# Altium schematic sheet AUDIO.SchDoc
size A3; DocumentNumber: 9; SheetNumber: 9; SheetTotal: 12
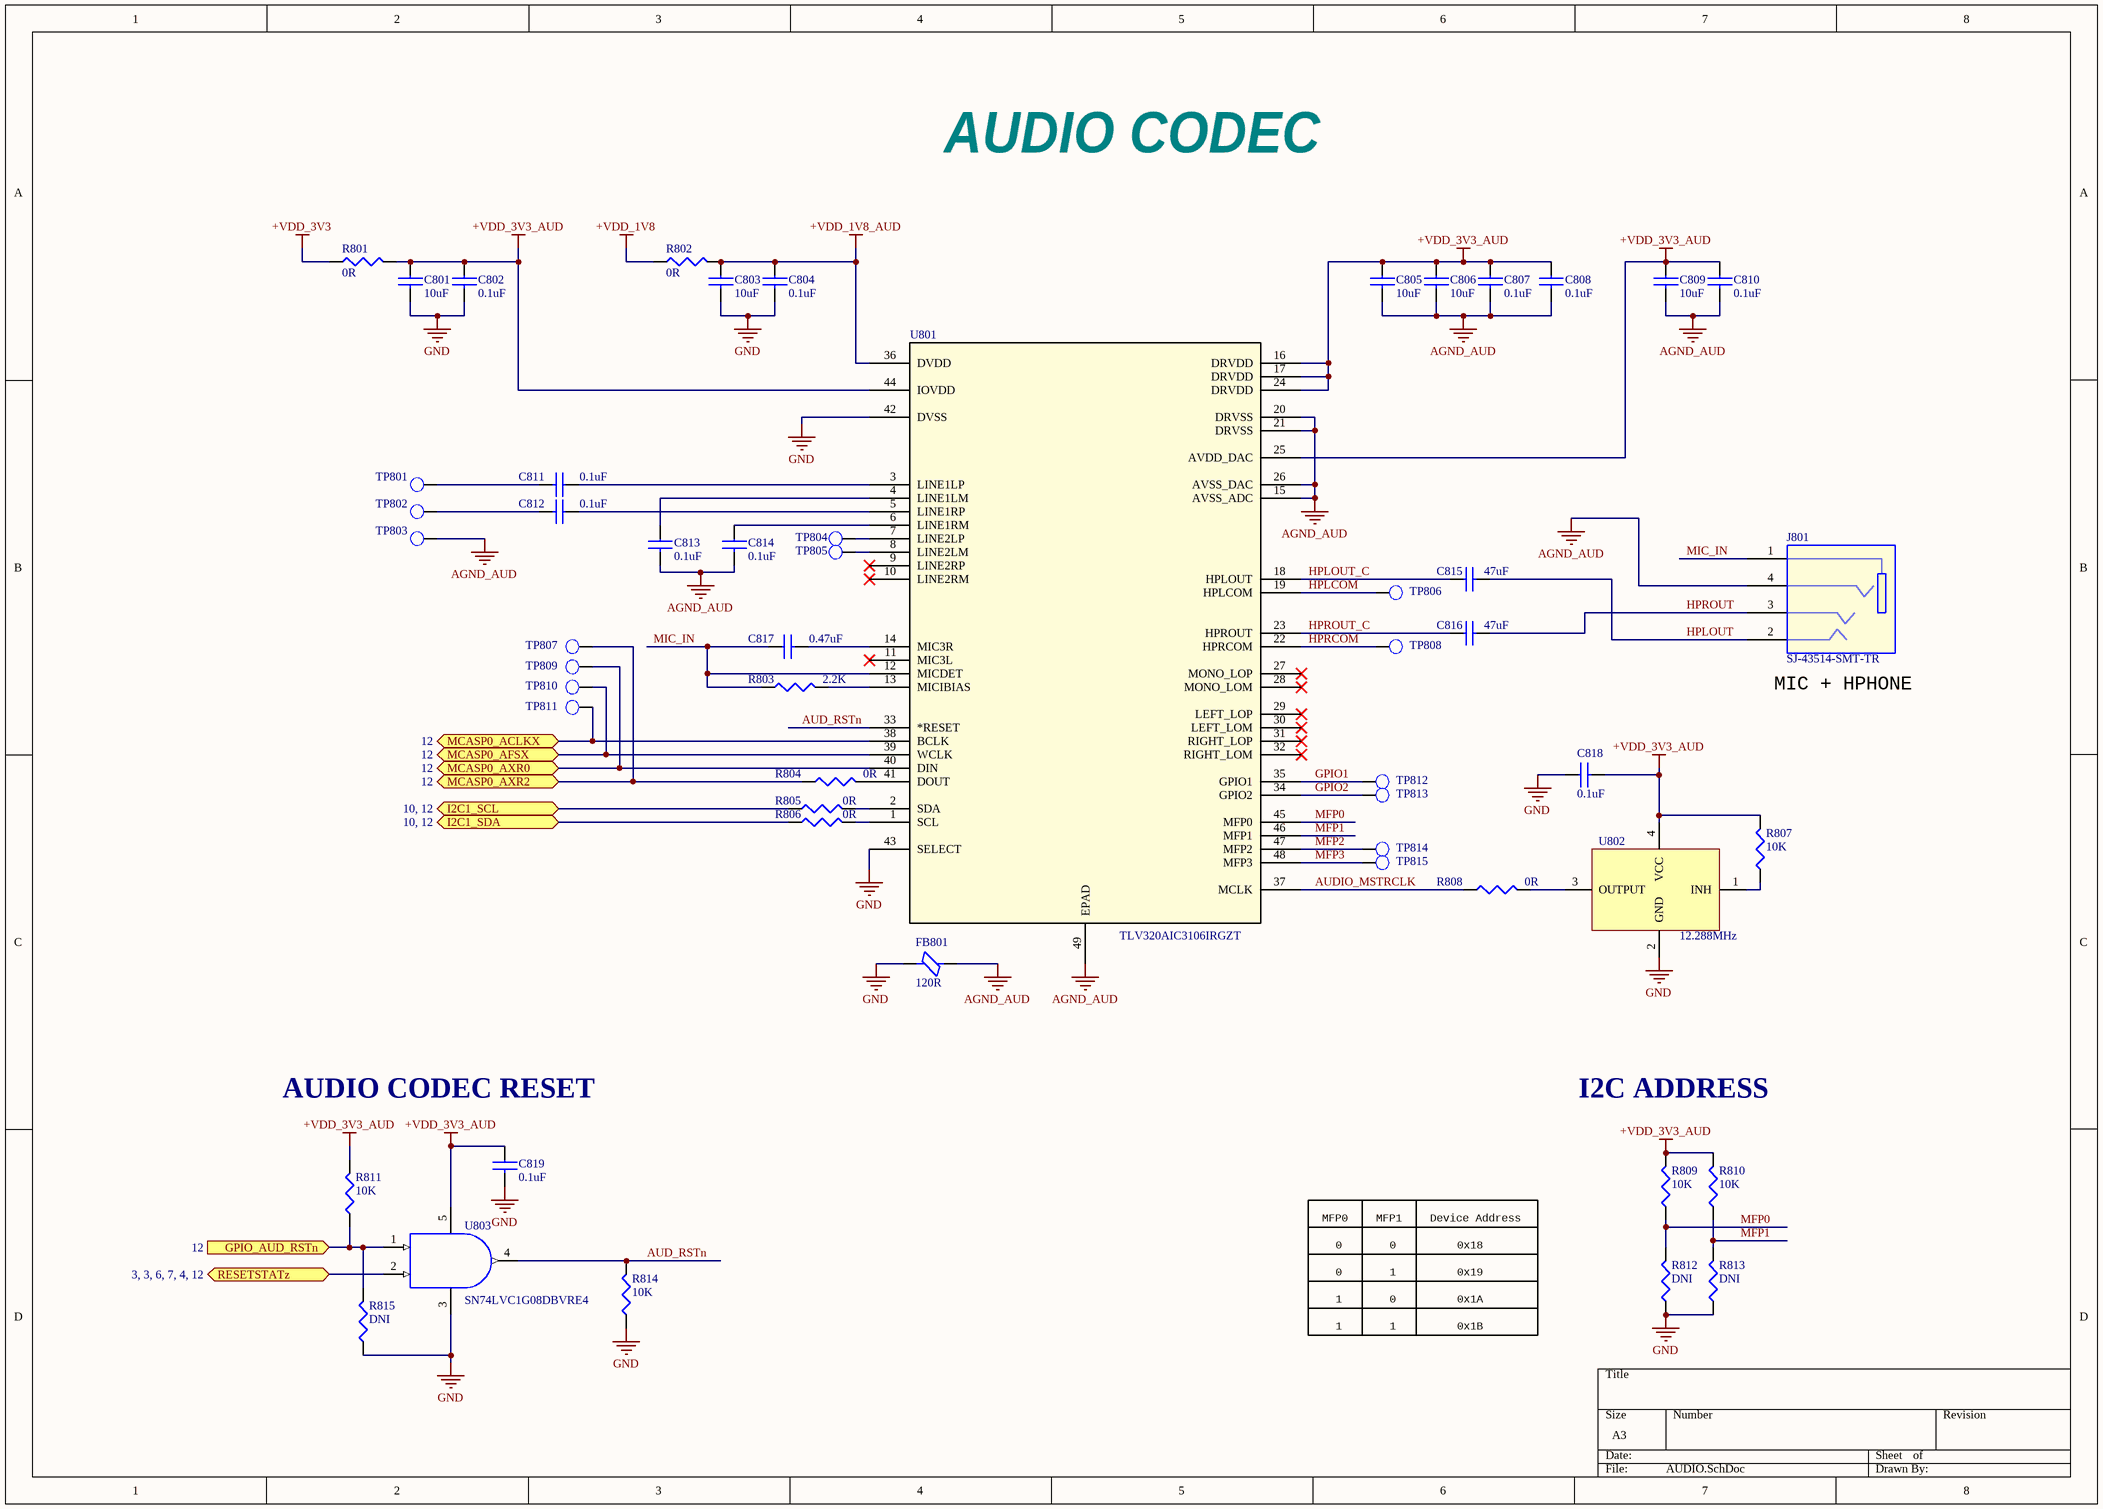
[diagram p0: AUDIO.SchDoc]

## Parts
C801  10uF  [C0402]
C802  0.1uF  [C0201]
C803  10uF  [C0402]
C804  0.1uF  [C0201]
C805  10uF  [C0402]
C806  10uF  [C0402]
C807  0.1uF  [C0201]
C808  0.1uF  [C0201]
C809  10uF  [C0402]
C810  0.1uF  [C0201]
C811  0.1uF  [C0402]
C812  0.1uF  [C0402]
C813  0.1uF  [C0201]
C814  0.1uF  [C0201]
C815  47uF  [C1206B/3216MM]
C816  47uF  [C1206B/3216MM]
C817  0.47uF  [C0402]
C818  0.1uF  [C0201]
C819  0.1uF  [C0402]
FB801  120R  [FB0402]
J801  SJ-43514-SMT-TR  [CON_AV4_SJ-43514-SMT_S_R_S_5-1]
R801  0R  [R0201]
R802  0R  [R0201]
R803  2.2K  [R0201]
R804  0R  [R0201]
R805  0R  [R0402]
R806  0R  [R0402]
R807  10K  [R0201]
R808  0R  [R0201]
R809  10K  [R0201]
R810  10K  [R0201]
R811  10K  [R0201]
R812  DNI  [R0201]
R813  DNI  [R0201]
R814  10K  [R0201]
R815  DNI  [R0201]
TP801  THRU HOLE  [TP_40X65]  (value not drawn)
TP802  THRU HOLE  [TP_40X65]  (value not drawn)
TP803  THRU HOLE  [TP_40X65]  (value not drawn)
TP804  TP20_SMD  [TP20_SMD]  (value not drawn)
TP805  TP20_SMD  [TP20_SMD]  (value not drawn)
TP806  TP20_SMD  [TP20_SMD]  (value not drawn)
TP807  TP20_SMD  [TP20_SMD]  (value not drawn)
TP808  TP20_SMD  [TP20_SMD]  (value not drawn)
TP809  TP20_SMD  [TP20_SMD]  (value not drawn)
TP810  TP20_SMD  [TP20_SMD]  (value not drawn)
TP811  TP20_SMD  [TP20_SMD]  (value not drawn)
TP812  TP20_SMD  [TP20_SMD]  (value not drawn)
TP813  TP20_SMD  [TP20_SMD]  (value not drawn)
TP814  TP20_SMD  [TP20_SMD]  (value not drawn)
TP815  TP20_SMD  [TP20_SMD]  (value not drawn)
U801  TLV320AIC3106IRGZT  [VQFN48_19-68_285X285]
U802  12.288MHz  [OSC4_KC2520B_100X80_SMD_0-8]
U803  SN74LVC1G08DBVRE4  [SOT23-5]

## Ports
GPIO_AUD_RSTn (in, see 12), I2C1_SCL (bidir, see 10, 12), I2C1_SDA (bidir, see 10, 12), MCASP0_ACLKX (bidir, see 12), MCASP0_AFSX (bidir, see 12), MCASP0_AXR0 (bidir, see 12), MCASP0_AXR2 (bidir, see 12), RESETSTATz (bidir, see 3, 3, 6, 7, 4, 12)

## Nets
+VDD_1V8: R802.1
+VDD_1V8_AUD: C803.1 C804.1 R802.2 U801.36(DVDD)
+VDD_3V3: R801.1
+VDD_3V3_AUD: C801.1 C802.1 C805.1 C806.1 C807.1 C808.1 C809.1 C810.1 C818.2 C819.1 R801.2 R807.2 R809.2 R810.2 R811.2 U801.16(DRVDD) U801.17(DRVDD) U801.24(DRVDD) U801.25(AVDD_DAC) U801.44(IOVDD) U802.4(VCC) U803.5(V+)
AGND_AUD: C805.2 C806.2 C807.2 C808.2 C809.2 C810.2 C813.2 C814.2 FB801.1 J801.4 TP803.1(TP) U801.15(AVSS_ADC) U801.20(DRVSS) U801.21(DRVSS) U801.26(AVSS_DAC) U801.49(EPAD)
GND: C801.2 C802.2 C803.2 C804.2 C818.1 C819.2 FB801.2 R812.1 R813.1 R814.1 R815.1 U801.42(DVSS) U801.43(SELECT) U802.2(GND) U803.3(V-)
AUD_RSTn: R814.2 U801.33(*RESET) U803.4(Y)
AUDIO_MSTRCLK: R808.1 U801.37(MCLK)
GPIO1: TP812.1(TP) U801.35(GPIO1)
GPIO2: TP813.1(TP) U801.34(GPIO2)
GPIO_AUD_RSTn: R811.1 R815.2 U803.1(A) ; port GPIO_AUD_RSTn
HPLCOM: TP806.1(TP) U801.19(HPLCOM)
HPLOUT: C815.2 J801.2
HPLOUT_C: C815.1 U801.18(HPLOUT)
HPRCOM: TP808.1(TP) U801.22(HPRCOM)
HPROUT: C816.2 J801.3
HPROUT_C: C816.1 U801.23(HPROUT)
I2C1_SCL: R805.1 ; port I2C1_SCL
I2C1_SDA: R806.1 ; port I2C1_SDA
MCASP0_ACLKX: TP811.1(TP) U801.38(BCLK) ; port MCASP0_ACLKX
MCASP0_AFSX: TP810.1(TP) U801.39(WCLK) ; port MCASP0_AFSX
MCASP0_AXR0: TP809.1(TP) U801.40(DIN) ; port MCASP0_AXR0
MCASP0_AXR2: R804.1 TP807.1(TP) ; port MCASP0_AXR2
MFP0: R809.1 R812.2 U801.45(MFP0)
MFP1: R810.1 R813.2 U801.46(MFP1)
MFP2: TP814.1(TP) U801.47(MFP2)
MFP3: TP815.1(TP) U801.48(MFP3)
MIC_IN: C817.1 J801.1 R803.1 U801.12(MICDET)
RESETSTATz: U803.2(B) ; port RESETSTATz
NetC811_1: C811.1 U801.3(LINE1LP)
NetC811_2: C811.2 TP801.1(TP)
NetC812_1: C812.1 U801.5(LINE1RP)
NetC812_2: C812.2 TP802.1(TP)
NetC813_1: C813.1 U801.4(LINE1LM)
NetC814_1: C814.1 U801.6(LINE1RM)
NetC817_2: C817.2 U801.14(MIC3R)
NetR803_2: R803.2 U801.13(MICIBIAS)
NetR804_2: R804.2 U801.41(DOUT)
NetR805_2: R805.2 U801.2(SDA)
NetR806_2: R806.2 U801.1(SCL)
NetR807_1: R807.1 U802.1(INH)
NetR808_2: R808.2 U802.3(OUTPUT)
NetTP804_1: TP804.1(TP) U801.7(LINE2LP)
NetTP805_1: TP805.1(TP) U801.8(LINE2LM)

Not connected (* = marked no-connect by the designer): U801 9(LINE2RP)* 10(LINE2RM)* 11(MIC3L)* 27(MONO_LOP)* 28(MONO_LOM)* 29(LEFT_LOP)* 30(LEFT_LOM)* 31(RIGHT_LOP)* 32(RIGHT_LOM)*

## Notes on the sheet
- AUDIO CODEC
- (near J801) MIC + HPHONE
- AUDIO CODEC RESET
- I2C ADDRESS
- MFP0
- 0
- MFP1
- Device Address
- 0x18
- 1
- 0x19
- 0x1A
- 0x1B

## Library data of the parts
C801 C803 C805 C806 C809 = GRM155R61A106ME11D: Multilayer Ceramic Capacitor, 10 uF, 10 V, ± 20%, X5R, 0402 [1005 Metric]; Manufacturer: Murata; Material: 4241ConductorMaterial; Dielectric: 1537DielectricType; Voltage Rating: 10V; Supplier 1: Arrow Electronics; Manufacturer Part Number: GRM155R61A106ME11D; RoHS: Yes; Category: Ceramic Capacitors; Stock 1: 100072; Pricing 1: 1=0.08, 10=0.054, 25=0.0281 (USD); Case/Package: 343Case; Min Operating Temperature: -55°C; Max Operating Temperature: 85°C; Capacitance: 10uF; Tolerance: 20%; Voltage Rating (DC): 10V; Length: 1mm; Width: 500um; Height: 700um; Thickness: 500um; RoHS Compliant: Yes; ComponentLink1URL: https://datasheet.octopart.com/GRM155R61A106ME11D-Murata-datasheet-155239053.pdf?src-supplier=Element14; ComponentLink1Description: https://datasheet.octopart.com/GRM155R61A106ME11D-Murata-datasheet-155239053.pdf?src-supplier=Element14; ComponentLink2URL: https://datasheet.octopart.com/GRM155R61A106ME11D-Murata-datasheet-165579666.pdf?src-supplier=TME; ComponentLink2Description: https://datasheet.octopart.com/GRM155R61A106ME11D-Murata-datasheet-165579666.pdf?src-supplier=TME; Supplier Part Number 1: GRM155R61A106ME11D
C802 C804 C807 C808 C810 C813 C814 C818 = GRM033R61C104KE14D: Multilayer Ceramic Capacitor, 0.1 uF, 16 V, ± 10%, X5R, 0201 [0603 Metric]; Manufacturer: Murata; Material: 4241ConductorMaterial; Capacitance: 100nF; Voltage Rating (DC): 16V; Supplier 1: Arrow Electronics; Manufacturer Part Number: GRM033R61C104KE14D; RoHS: Yes; Category: Ceramic Capacitors; Stock 1: 8280000; Pricing 1: 15000=0.0039 (USD); Mount: Surface Mount; Case/Package: 0201; Case Code (Imperial): 0201; Case Code (Metric): 0603; Min Operating Temperature: -55°C; Max Operating Temperature: 85°C; Tolerance: 10%; Dielectric: X5R; Series: GRM; Voltage Rating: 16V; Packaging: Tape and Reel; Length: 600um; Width: 300um; Height: 330um; Thickness: 300um; RoHS Compliant: Yes; ComponentLink1URL: http://www.farnell.com/datasheets/2892233.pdf?src-supplier=Farnell; ComponentLink1Description: http://www.farnell.com/datasheets/2892233.pdf?src-supplier=Farnell; ComponentLink2URL: http://www.farnell.com/datasheets/2892233.pdf?src-supplier=Newark; ComponentLink2Description: http://www.farnell.com/datasheets/2892233.pdf?src-supplier=Newark; ComponentLink3URL: http://search.murata.co.jp/Ceramy/image/img/A01X/G101/ENG/GRM033R61C104KE14-01.pdf?src-supplier=Digikey; ComponentLink3Description: http://search.murata.co.jp/Ceramy/image/img/A01X/G101/ENG/GRM033R61C104KE14-01.pdf?src-supplier=Digikey; ComponentLink4URL: https://search.murata.co.jp/Ceramy/image/img/A01X/G101/ENG/GRM033R61C104KE14-01.pdf?src-supplier=Digikey; ComponentLink4Description: https://search.murata.co.jp/Ceramy/image/img/A01X/G101/ENG/GRM033R61C104KE14-01.pdf?src-supplier=Digikey; ComponentLink5URL: https://datasheet.octopart.com/GRM033R61C104KE14D-Murata-datasheet-165579666.pdf?src-supplier=TME; ComponentLink5Description: https://datasheet.octopart.com/GRM033R61C104KE14D-Murata-datasheet-165579666.pdf?src-supplier=TME; Supplier Part Number 1: GRM033R61C104KE14D
C811 C812 C819 = GRM155R71H104KE14D: Multilayer Ceramic Capacitor, 0.1 uF, 50 V, ± 10%, X7R, 0402 [1005 Metric]; Manufacturer: Murata; Capacitance: 100nF; Voltage Rating: 50V; Dissipation Factor: 0.025%; Supplier 1: Arrow Electronics; Manufacturer Part Number: GRM155R71H104KE14D; RoHS: Yes; Category: Ceramic Capacitors; Stock 1: 6020000; Pricing 1: 10000=0.0046, 30000=0.0042, 50000=0.0037, 100000=0.0028 (USD); Mount: Surface Mount; Case/Package: 0402; Number of Pins: 2NUMBER; Case Code (Metric): 1005; Material: Ceramic; Case Code (Imperial): 0402; Weight: 0.000212oz; Dielectric Material: Ceramic; Min Operating Temperature: -55°C; Max Operating Temperature: 125°C; Tolerance: 10%; Packaging: Tape and Reel; Dielectric: X7R; Termination: SMD/SMT; Voltage: 50V; Voltage Rating (DC): 50V; Package Quantity: 10000; Series: GRM; Construction: Flat; Length: 1mm; Width: 0.5mm; Height: 0.5mm; Thickness: 0.022inch; Depth: 0.5mm; Reach SVHC Compliant: No; RoHS Compliant: Yes; Lead Free: 5697LeadFree; ComponentLink1URL: http://www.farnell.com/datasheets/2079156.pdf?src-supplier=Farnell; ComponentLink1Description: http://www.farnell.com/datasheets/2079156.pdf?src-supplier=Farnell; ComponentLink2URL: http://www.mouser.com/ds/2/281/c02e-2905.pdf?src-supplier=Mouser; ComponentLink2Description: http://www.mouser.com/ds/2/281/c02e-2905.pdf?src-supplier=Mouser; ComponentLink3URL: https://datasheet.octopart.com/GRM155R71H104KE14D-Murata-datasheet-22122223.pdf?src-supplier=Future+Electronics; ComponentLink3Description: https://datasheet.octopart.com/GRM155R71H104KE14D-Murata-datasheet-22122223.pdf?src-supplier=Future+Electronics; ComponentLink4URL: http://www.farnell.com/datasheets/2079156.pdf?src-supplier=Newark; ComponentLink4Description: http://www.farnell.com/datasheets/2079156.pdf?src-supplier=Newark; ComponentLink5URL: https://datasheet.octopart.com/GRM155R71H104KE14D-Murata-datasheet-66077078.pdf?src-supplier=Element14; ComponentLink5Description: https://datasheet.octopart.com/GRM155R71H104KE14D-Murata-datasheet-66077078.pdf?src-supplier=Element14; ComponentLink6URL: https://search.murata.co.jp/Ceramy/image/img/A01X/G101/ENG/GRM155R71H104KE14-01.pdf?src-supplier=Digikey; ComponentLink6Description: https://search.murata.co.jp/Ceramy/image/img/A01X/G101/ENG/GRM155R71H104KE14-01.pdf?src-supplier=Digikey; Supplier Part Number 1: GRM155R71H104KE14D
C815 C816 = GRM31CR61A476ME15L: Multilayer Ceramic Capacitor, 47 uF, 10 V, ± 20%, X5R, 1206 [3216 Metric]; Manufacturer: Murata; Supplier 1: Arrow Electronics; Manufacturer Part Number: GRM31CR61A476ME15L; RoHS: Yes; Category: Ceramic Capacitors; Stock 1: 120000; Pricing 1: 2000=0.1162, 4000=0.1078, 10000=0.0977, 50000=0.0818 (USD); ComponentLink1URL: https://datasheet.ciiva.com/6031/1697710-6031936.pdf?src-supplier=Farnell; ComponentLink1Description: https://datasheet.ciiva.com/6031/1697710-6031936.pdf?src-supplier=Farnell; ComponentLink2URL: https://datasheet.ciiva.com/3779/2151grm31cr61a476me1523-3779480.pdf?src-supplier=Arrow+Electronics; ComponentLink2Description: https://datasheet.ciiva.com/3779/2151grm31cr61a476me1523-3779480.pdf?src-supplier=Arrow+Electronics; ComponentLink3URL: https://datasheet.ciiva.com/16461/product-16461242.pdf?src-supplier=Future+Electronics; ComponentLink3Description: https://datasheet.ciiva.com/16461/product-16461242.pdf?src-supplier=Future+Electronics; ComponentLink4URL: https://datasheet.ciiva.com/7719/1697710-7719146.pdf?src-supplier=Element14; ComponentLink4Description: https://datasheet.ciiva.com/7719/1697710-7719146.pdf?src-supplier=Element14; ComponentLink5URL: https://datasheet.ciiva.com/5416/product-5416711.pdf?src-supplier=Mouser; ComponentLink5Description: https://datasheet.ciiva.com/5416/product-5416711.pdf?src-supplier=Mouser; ComponentLink6URL: https://datasheet.ciiva.com/14116/grmseries-highdielectrictype-eng-14116399.pdf?src-supplier=Distrelec; ComponentLink6Description: https://datasheet.ciiva.com/14116/grmseries-highdielectrictype-eng-14116399.pdf?src-supplier=Distrelec; ComponentLink7URL: https://datasheet.ciiva.com/11606/product-11606488.pdf?src-supplier=Avnet; ComponentLink7Description: https://datasheet.ciiva.com/11606/product-11606488.pdf?src-supplier=Avnet; ComponentLink8URL: https://datasheet.ciiva.com/141/partnumbering-e-01-141779.pdf?src-supplier=Digikey; ComponentLink8Description: https://datasheet.ciiva.com/141/partnumbering-e-01-141779.pdf?src-supplier=Digikey; ComponentLink9URL: https://datasheet.ciiva.com/141/partnumbering-e-01-141780.pdf?src-supplier=Digikey; ComponentLink9Description: https://datasheet.ciiva.com/141/partnumbering-e-01-141780.pdf?src-supplier=Digikey; ComponentLink10URL: https://datasheet.ciiva.com/141/partnumbering-e-01-141781.pdf?src-supplier=Digikey; ComponentLink10Description: https://datasheet.ciiva.com/141/partnumbering-e-01-141781.pdf?src-supplier=Digikey; Supplier Part Number 1: GRM31CR61A476ME15L
C817 = GRM155R71A474KE01D: Multilayer Ceramic Capacitor, 0.47 uF, 10 V, ± 10%, X7R, 0402 [1005 Metric]; Manufacturer: Murata; Voltage Rating (DC): 10V; Capacitance: 470nF; Supplier 1: Arrow Electronics; Manufacturer Part Number: GRM155R71A474KE01D; RoHS: Yes; Category: Ceramic Capacitors; Stock 1: 75675; Pricing 1: 1=0.1817, 10=0.1593, 25=0.1555, 100=0.1462, 250=0.1449, 500=0.1371, 1000=0.1361, 3000=0.1351, 6000=0.1341, 15000=0.1331, 30000=0.1322, 75000=0.1312 (USD); Case/Package: 0402; Number of Pins: 2NUMBER; Material: Ceramic; Min Operating Temperature: -55°C; Max Operating Temperature: 125°C; Tolerance: 10%; Voltage Rating: 10V; Length: 1mm; Width: 0.5mm; Height: 0.3mm; Thickness: 500um; Lead Free: Lead Free; RoHS Compliant: Yes; ComponentLink1URL: https://datasheet.octopart.com/GRM155R71A474KE01D-Murata-datasheet-149523060.pdf?src-supplier=Newark; ComponentLink1Description: https://datasheet.octopart.com/GRM155R71A474KE01D-Murata-datasheet-149523060.pdf?src-supplier=Newark; ComponentLink2URL: https://datasheet.octopart.com/GRM155R71A474KE01D-Murata-datasheet-32479577.pdf?src-supplier=Future+Electronics; ComponentLink2Description: https://datasheet.octopart.com/GRM155R71A474KE01D-Murata-datasheet-32479577.pdf?src-supplier=Future+Electronics; ComponentLink3URL: http://search.murata.co.jp/Ceramy/image/img/A01X/G101/ENG/GRM155R71A474KE01-01.pdf?src-supplier=Digikey; ComponentLink3Description: http://search.murata.co.jp/Ceramy/image/img/A01X/G101/ENG/GRM155R71A474KE01-01.pdf?src-supplier=Digikey; ComponentLink4URL: https://datasheet.octopart.com/GRM155R71A474KE01D-Murata-datasheet-165579666.pdf?src-supplier=TME; ComponentLink4Description: https://datasheet.octopart.com/GRM155R71A474KE01D-Murata-datasheet-165579666.pdf?src-supplier=TME; Supplier Part Number 1: GRM155R71A474KE01D
FB801 = BLM15PD121SZ1D: Ferrite Beads Multi-Layer 120Ohm 25% 100MHz 1.3A 0.09Ohm DCR 0402 Automotive T/R; Manufacturer: Murata; Core Material: 228ConductorMaterial; Number of Lines: 1; Resistance: 90mR; Supplier 1: Arrow Electronics; Manufacturer Part Number: BLM15PD121SZ1D; RoHS: Yes; Category: Ferrite Beads and Chips; Stock 1: 10000; Pricing 1: 10000=0.0178, 20000=0.0168, 30000=0.016, 50000=0.0158 (USD); Mount: Surface Mount; Case/Package: 0402; Case Code (Imperial): 0402; Case Code (Metric): 1005; Min Operating Temperature: -55°C; Max Operating Temperature: 125°C; Packaging: Cut Tape; Max Current Rating: 1.3A; Series: EMIFIL®, BLM15; RMS Current (Irms): 1.3A; Series Resistance: 90mR; Test Frequency: 100MHz; Tolerance: 25%; Height: 550um; Ratings: AEC-Q200; RoHS Compliant: Yes; ComponentLink1URL: https://www.murata.com/en-us/products/productdata/8796748677150/QNFA9118.pdf?src-supplier=Digi-Key; ComponentLink1Description: https://www.murata.com/en-us/products/productdata/8796748677150/QNFA9118.pdf?src-supplier=Digi-Key; Supplier Part Number 1: BLM15PD121SZ1D
J801 = SJ-43514-SMT-TR: 3.5 mm, 4 Conductors, Right Angle, Surface Mount (SMT), Audio Jack Connector; Manufacturer: CUI Devices; Supplier 1: Arrow Electronics; Manufacturer Part Number: SJ-43514-SMT-TR; RoHS: Yes; Category: Audio / Video Connectors; Stock 1: 15500; Pricing 1: 5000=0.498, 6000=0.493, 10000=0.4893 (USD); ComponentLink1URL: https://datasheet.octopart.com/SJ-43514-SMT-TR-CUI-Devices-datasheet-137916562.pdf?src-supplier=Future+Electronics; ComponentLink1Description: https://datasheet.octopart.com/SJ-43514-SMT-TR-CUI-Devices-datasheet-137916562.pdf?src-supplier=Future+Electronics; ComponentLink2URL: https://www.cuidevices.com/product/resource/digikeypdf/sj-4351x-smt.pdf?src-supplier=Digikey; ComponentLink2Description: https://www.cuidevices.com/product/resource/digikeypdf/sj-4351x-smt.pdf?src-supplier=Digikey; Supplier Part Number 1: SJ-43514-SMT-TR
R801 R802 R804 R808 = RC0201JR-070RL: Zero Ohm Resistor, Jumper, 0201 [0603 Metric], Thick Film, 50 mW, 500 mA, Surface Mount; Manufacturer: Yageo; Power Rating: 50mW; Tolerance: 5%; Voltage Rating: 25V; Temperature Coefficient: 200ppm/°C; Supplier 1: Future Electronics; Manufacturer Part Number: RC0201JR-070RL; RoHS: Yes; Category: Chip SMD Resistors; Stock 1: 7600000; Pricing 1: 10000=0.0009, 50000=0.0009, 250000=0.0008, 500000=0.0008, 1500000=0.0007 (USD); Case/Package: 0201; Contact Plating: Tin,Matte; Case Code (Metric): 0603; Case Code (Imperial): 0201; Weight: 6E-06oz; Size Code: 0201; Min Operating Temperature: -55°C; Max Operating Temperature: 125°C; Resistor Type: Thick Film; Packaging: Tape and Reel; Resistance: 0R; Package Quantity: 1; Series: RC; Number of Terminations: 2; Termination: SMD/SMT; Max Power Dissipation: 50mW; Voltage Rating (DC): 25V; Features: Moisture Resistant; Resistance Tolerance: 5%; Length: 0.024inch; Width: 0.012inch; Height: 0.01inch; RoHS Compliant: Yes; Lead Free: Lead Free; Reach SVHC Compliant: Unknown; ComponentLink1URL: https://datasheet.ciiva.com/7672/1563626-7672248.pdf?src-supplier=Element14; ComponentLink1Description: https://datasheet.ciiva.com/7672/1563626-7672248.pdf?src-supplier=Element14; ComponentLink2URL: https://datasheet.ciiva.com/7660/1421516-7660808.pdf?src-supplier=Element14; ComponentLink2Description: https://datasheet.ciiva.com/7660/1421516-7660808.pdf?src-supplier=Element14; ComponentLink3URL: https://datasheet.ciiva.com/8896/pyu-rc0201-51-rohs-l-8-8896143.pdf?src-supplier=Avnet; ComponentLink3Description: https://datasheet.ciiva.com/8896/pyu-rc0201-51-rohs-l-8-8896143.pdf?src-supplier=Avnet; ComponentLink4URL: https://datasheet.ciiva.com/7672/1563626-7672247.pdf?src-supplier=Element14; ComponentLink4Description: https://datasheet.ciiva.com/7672/1563626-7672247.pdf?src-supplier=Element14; ComponentLink5URL: https://datasheet.ciiva.com/46391/1421516-46391340.pdf?src-supplier=Element14; ComponentLink5Description: https://datasheet.ciiva.com/46391/1421516-46391340.pdf?src-supplier=Element14; Supplier Part Number 1: 9983388
R803 = RC0201FR-072K2L: SMD Chip Resistor, 2.2 kOhm, ± 1%, 50 mW, 0201 [0603 Metric], Thick Film, General Purpose; Manufacturer: Yageo; Supplier 1: Future Electronics; Manufacturer Part Number: RC0201FR-072K2L; RoHS: Yes; Category: Chip SMD Resistors; Stock 1: 2030000; Pricing 1: 10000=0.0008, 50000=0.0008, 300000=0.0007, 1000000=0.0007, 3000000=0.0006 (USD); ComponentLink1URL: https://datasheet.ciiva.com/7672/1563626-7672218.pdf?src-supplier=Element14; ComponentLink1Description: https://datasheet.ciiva.com/7672/1563626-7672218.pdf?src-supplier=Element14; Supplier Part Number 1: 3937737
R805 R806 = RC0402JR-070RL: Zero Ohm Resistor, Jumper, 0402 [1005 Metric], Thick Film, 63 mW, 1 A, Surface Mount; Manufacturer: Yageo; Resistance: 0mR; Power Rating: 62.5mW; Tolerance: 5%; Voltage Rating: 50V; Max Power Dissipation: 63mW; Temperature Coefficient: 200ppm/°C; Supplier 1: Future Electronics; Manufacturer Part Number: RC0402JR-070RL; RoHS: Yes; Category: Chip SMD Resistors; Stock 1: 51030000; Pricing 1: 10000=0.0009, 50000=0.0008, 250000=0.0008, 500000=0.0007, 1500000=0.0007 (USD); Case/Package: 0402; Contact Plating: Tin,Matte; Case Code (Metric): 1005; Case Code (Imperial): 0402; Size Code: 0402; Min Operating Temperature: -55°C; Max Operating Temperature: 155°C; Packaging: Tape and Reel; Resistor Type: Thick Film; Number of Terminations: 2; Termination: SMD/SMT; Features: Moisture Resistant; Series: RC; Package Quantity: 1; Technology: THICK FILM; Resistance Tolerance: 5%; Construction: Rectangular; Length: 1mm; Width: 0.02inch; Height: 0.016inch; Depth: 0.5mm; Lead Free: 5697LeadFree; Reach SVHC Compliant: Unknown; RoHS Compliant: Yes; Military Standard: Not; Supplier Part Number 1: 3375797
R807 R809-R815 = RC0201JR-0710KL: Res Thick Film 0201 10K Ohm 5% 1/20W ±200ppm/°C Molded SMD SMD Paper T/R; Manufacturer: Yageo; Resistance: 10kR; Power Rating: 50mW; Voltage Rating: 25V; Supplier 1: Future Electronics; Manufacturer Part Number: RC0201JR-0710KL; RoHS: Yes; Category: Chip SMD Resistors; Stock 1: 90000; Pricing 1: 10000=0.0006, 100000=0.0006, 400000=0.0005, 1250000=0.0005, 4000000=0.0005 (USD); Case/Package: 0201; Contact Plating: Tin,Matte; Case Code (Imperial): 0201; Case Code (Metric): 0603; Size Code: 0201; Min Operating Temperature: -55°C; Max Operating Temperature: 125°C; Tolerance: 5%; Resistor Type: Thick Film; Temperature Coefficient: 200ppm/°C; Packaging: Tape and Reel; Termination: SMD/SMT; Voltage Rating (DC): 25V; Features: Moisture Resistant; Series: RC; Max Power Dissipation: 50mW; Number of Terminations: 2; Resistance Tolerance: 5%; Lead Free: Lead Free; RoHS Compliant: Yes; Reach SVHC Compliant: Unknown; ComponentLink1URL: https://datasheet.ciiva.com/7660/1421516-7660810.pdf?src-supplier=Element14; ComponentLink1Description: https://datasheet.ciiva.com/7660/1421516-7660810.pdf?src-supplier=Element14; ComponentLink2URL: https://datasheet.ciiva.com/8891/pyu-rc0201-51-rohs-l-8-8891388.pdf?src-supplier=Avnet; ComponentLink2Description: https://datasheet.ciiva.com/8891/pyu-rc0201-51-rohs-l-8-8891388.pdf?src-supplier=Avnet; ComponentLink3URL: https://datasheet.ciiva.com/7672/1563626-7672254.pdf?src-supplier=Element14; ComponentLink3Description: https://datasheet.ciiva.com/7672/1563626-7672254.pdf?src-supplier=Element14; ComponentLink4URL: https://datasheet.ciiva.com/7672/1563626-7672253.pdf?src-supplier=Element14; ComponentLink4Description: https://datasheet.ciiva.com/7672/1563626-7672253.pdf?src-supplier=Element14; ComponentLink5URL: https://datasheet.ciiva.com/46391/1421516-46391291.pdf?src-supplier=Element14; ComponentLink5Description: https://datasheet.ciiva.com/46391/1421516-46391291.pdf?src-supplier=Element14; Supplier Part Number 1: 5556147
TP801-TP803 = TESTPOINT: TESTPOINT 1.0MM DRILL PTH; Mfr_name: LOCAL; Mistral Part No: 130009030938; Project: HSE; PCB Footprint: TP_40X65; Library Ref: TESTPOINT; Datasheet: NA; Chkd/date: MAZHAR/271211; Crtd /date: SHREESHAIL/041005; Height: NA; Distributor_part_number: NA; Distributor_name: NA; Package: THRU-HOLE; Part_type: TESTPOINT; Mfr_part_number: TP_40X65
TP804-TP815 = TESTPOINT_1: TESTPOINT CIR 20 SMD; Mistral Part No: NA; Mfr_name: LOCAL; Project: BT MODULE_CSRBC04; PCB Footprint: TP20_SMD; RoHS: NA; Mfr_part_number: TP20_SMD; Part_type: TESTPOINT; Package: SMD; Distributor_name: NA; Distributor_part_number: NA; Height: NA; Crtd /date: MAZHAR/171006; Chkd/date: SHREESHAIL/171006; Tolerance: NA; Voltage: NA; Wattage: NA; Weight: NA; Temperature: NA; Datasheet: NA; MECHANICAL 3D STEP FILE: NA; Library Path: Y:\MIS_DATABASE\Library\ALTIUM_TOOL\SCHEMATICS_PARTS\MS_DISCRETE_Library.schlib; Footprint Path: Y:\MIS_DATABASE\Library\ALTIUM_TOOL\PCB_FOOTPRINTS\Altium_Footprint_Lib.PcbLib; Library Ref: TESTPOINT; Footprint Ref: TP20_SMD; Customs_HS_Code: NA; Custom_Duty: NA
U801 = TLV320AIC3204IRHBR: Very-Low-Power Stereo Audio CODEC With PowerTune Technology 32-VQFN -40 to 85; Manufacturer: Texas Instruments; Supplier 1: Mouser; Manufacturer Part Number: TLV320AIC3204IRHBR; RoHS: Yes; Category: Amplifiers - Audio; Stock 1: 4883; Pricing 1: 1=4.76, 10=4.28, 50=4.28, 100=3.5, 1000=2.51, 10000=2.39 (USD); ComponentLink1URL: https://datasheet.ciiva.com/1148/tlv320aic3204-1148166.pdf?src-supplier=Newark; ComponentLink1Description: https://datasheet.ciiva.com/1148/tlv320aic3204-1148166.pdf?src-supplier=Newark; ComponentLink2URL: https://datasheet.ciiva.com/1141/1764454-1141057.pdf?src-supplier=Element14; ComponentLink2Description: https://datasheet.ciiva.com/1141/1764454-1141057.pdf?src-supplier=Element14; ComponentLink3URL: https://datasheet.ciiva.com/26913/getdatasheetpartid-301856-26913275.pdf?src-supplier=Verical; ComponentLink3Description: https://datasheet.ciiva.com/26913/getdatasheetpartid-301856-26913275.pdf?src-supplier=Verical; ComponentLink4URL: https://datasheet.ciiva.com/28421/1887548-28421445.pdf?src-supplier=Element14; ComponentLink4Description: https://datasheet.ciiva.com/28421/1887548-28421445.pdf?src-supplier=Element14; ComponentLink5URL: https://datasheet.ciiva.com/1691/tlv320aic3204-1691483.pdf?src-supplier=Digi-Key; ComponentLink5Description: https://datasheet.ciiva.com/1691/tlv320aic3204-1691483.pdf?src-supplier=Digi-Key; ComponentLink6URL: https://datasheet.ciiva.com/1691/tlv320aic3204-1691484.pdf?src-supplier=Digi-Key; ComponentLink6Description: https://datasheet.ciiva.com/1691/tlv320aic3204-1691484.pdf?src-supplier=Digi-Key; ComponentLink7URL: https://datasheet.ciiva.com/1691/tlv320aic3204-1691485.pdf?src-supplier=Digi-Key; ComponentLink7Description: https://datasheet.ciiva.com/1691/tlv320aic3204-1691485.pdf?src-supplier=Digi-Key; Supplier Part Number 1: 595-V320AIC3204IRHBR
U802 = XTAL OSC XO 12.2880MHZ CMOS SMD: 12.288 MHz XO (Standard) CMOS Oscillator 1.71V ~ 3.63V Standby (Power Down) 4-SMD, No Lead; Manufacturer: Kyocera AVX; Manufacturer Part Number: KC2520Z12.2880C1KX00; Supplier 1: Digikey; RoHS: No; Stock 1: 9396; Pricing 1: 1=1.21, 10=1.066, 50=0.9966, 100=0.8806, 500=0.8343, 1000=0.69525 (USD); Supplier Part Number 1: 478-KC2520Z12.2880C1KX00CT-ND
U803 = SN74LVC1G08DBVRE4: Single 2-input, 1.65-V to 5.5-V AND gate 5-SOT-23 -40 to 125; Manufacturer: Texas Instruments; Output Current: 32mA; Number of Inputs: 2; Min Supply Voltage: 1.65V; Max Supply Voltage: 5.5V; Number of Outputs: 1; Propagation Delay: 4ns; Quiescent Current: 10uA; High Level Output Current: -32mA; Turn-On Delay Time: 4.5ns; Supplier 1: Mouser; Manufacturer Part Number: SN74LVC1G08DBVRE4; RoHS: Yes; Category: Logic Gates; Stock 1: 9321; Pricing 1: 1=0.41, 10=0.317, 50=0.317, 100=0.197, 1000=0.128, 10000=0.102 (USD); Mount: Surface Mount; Case/Package: SOT-23-5; Number of Pins: 5; Weight: 0.000557oz; Min Operating Temperature: -40°C; Max Operating Temperature: 125°C; Packaging: Tape and Reel; Logic Function: AND GATE; Package Quantity: 3000; Number of Circuits: 1; Low Level Output Current: 32mA; Number of Gates: 1; Number of Input Lines: 2; Number of Output Lines: 1; Number of Elements: 1; Number of Bits: 1; Series: 74LVC; Technology: CMOS; Radiation Hardening: No; Reach SVHC Compliant: No; Lead Free: Lead Free; RoHS Compliant: Yes; ComponentLink1URL: https://datasheet.ciiva.com/18572/sn74lvc1g08-18572331.pdf?src-supplier=Digi-Key; ComponentLink1Description: https://datasheet.ciiva.com/18572/sn74lvc1g08-18572331.pdf?src-supplier=Digi-Key; ComponentLink2URL: https://datasheet.ciiva.com/18572/sn74lvc1g08-18572330.pdf?src-supplier=Digi-Key; ComponentLink2Description: https://datasheet.ciiva.com/18572/sn74lvc1g08-18572330.pdf?src-supplier=Digi-Key; ComponentLink3URL: https://datasheet.ciiva.com/18572/sn74lvc1g08-18572332.pdf?src-supplier=Digi-Key; ComponentLink3Description: https://datasheet.ciiva.com/18572/sn74lvc1g08-18572332.pdf?src-supplier=Digi-Key; ComponentLink4URL: https://datasheet.ciiva.com/4818/sces217y-471056-4818205.pdf?src-supplier=Mouser; ComponentLink4Description: https://datasheet.ciiva.com/4818/sces217y-471056-4818205.pdf?src-supplier=Mouser; ComponentLink5URL: https://datasheet.ciiva.com/14312/sn74lvc1g08-14312069.pdf?src-supplier=Avnet; ComponentLink5Description: https://datasheet.ciiva.com/14312/sn74lvc1g08-14312069.pdf?src-supplier=Avnet; ComponentLink6URL: https://datasheet.ciiva.com/15221/getdatasheetpartid-394152-15221709.pdf?src-supplier=Verical; ComponentLink6Description: https://datasheet.ciiva.com/15221/getdatasheetpartid-394152-15221709.pdf?src-supplier=Verical; Supplier Part Number 1: 595-SN74LVC1G08DBRE4